# EAGLE design W076XX (EAGLE 6.6.0)
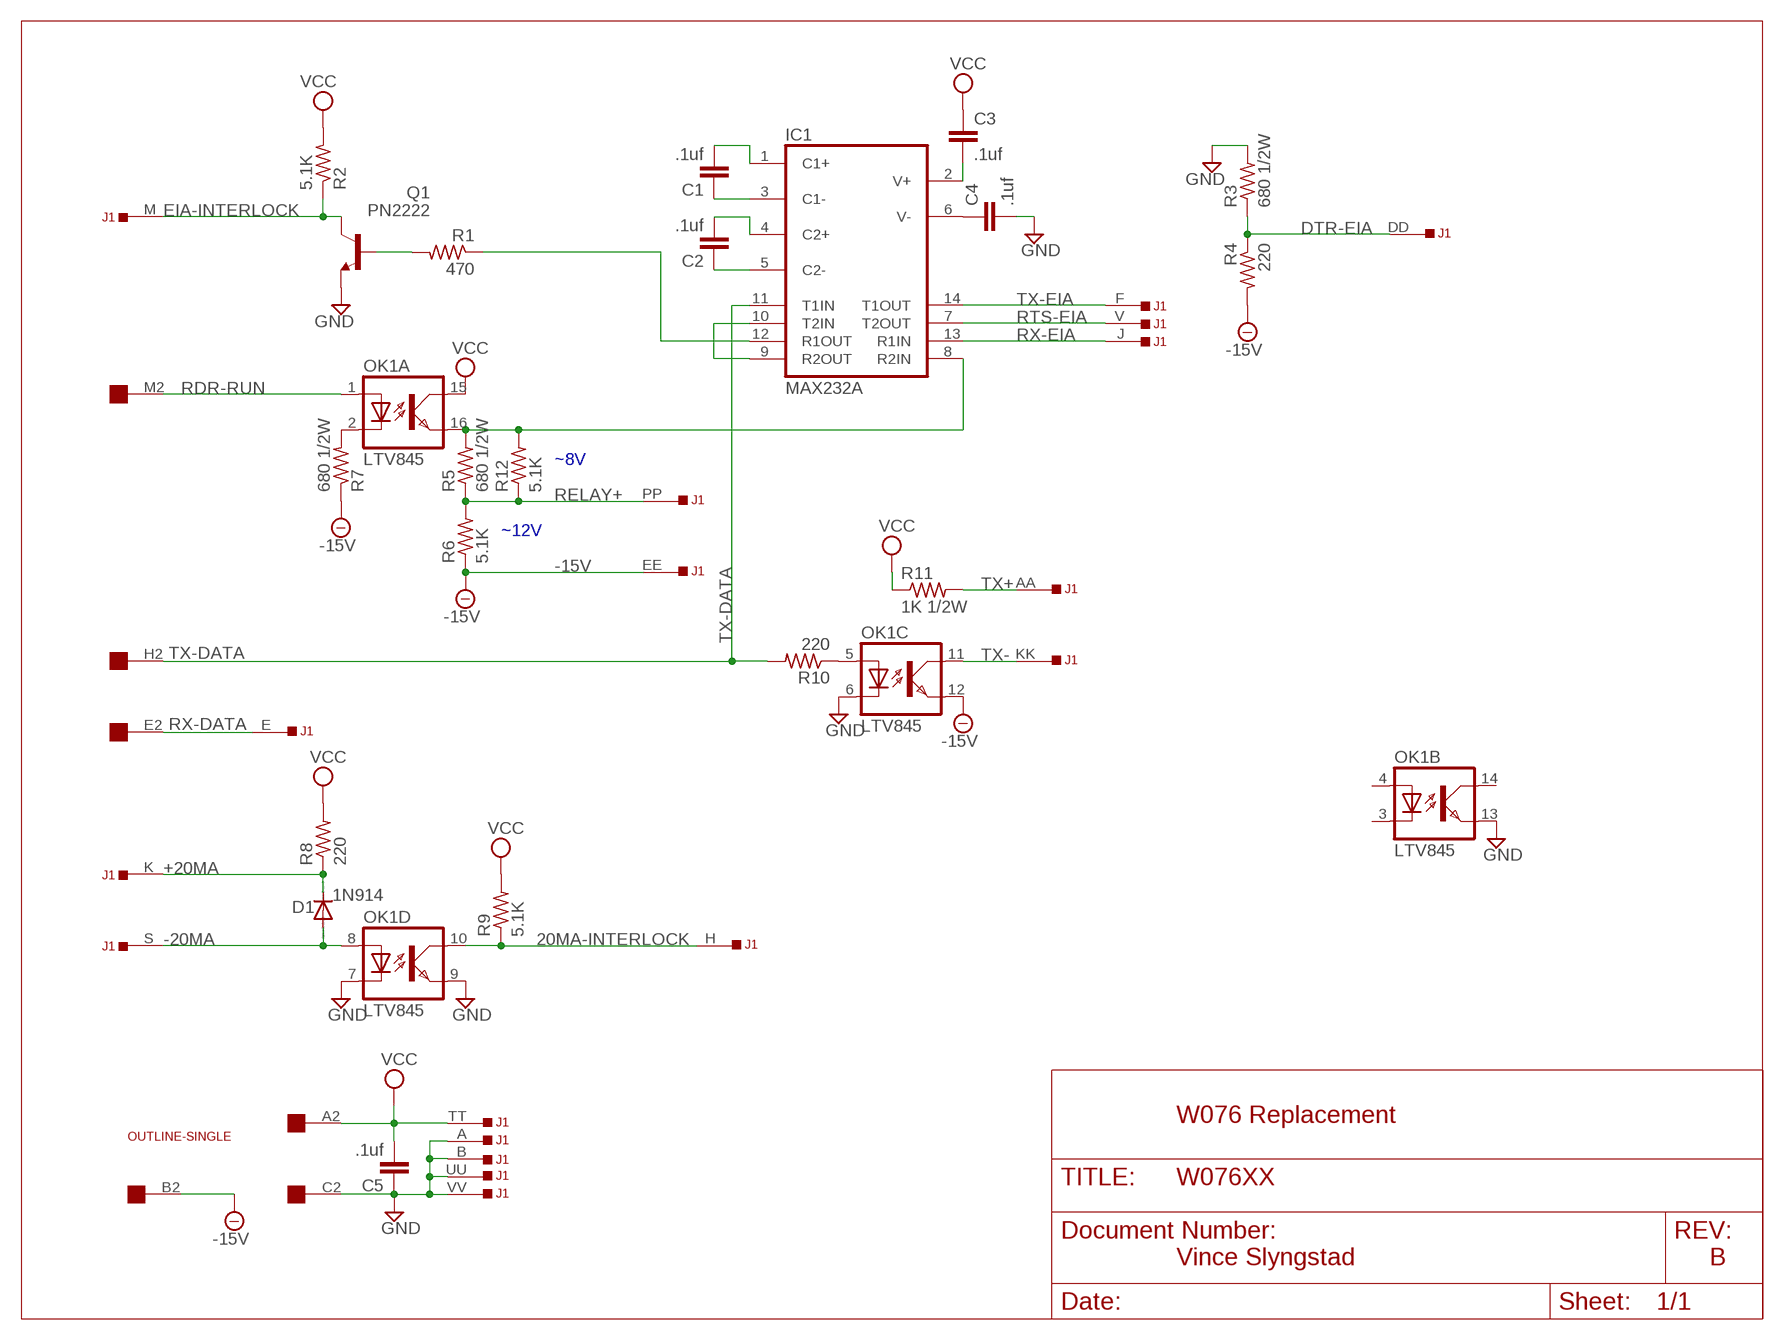
[diagram p0: schematic, sheet 1]

## Parts
C1  .1uf  C-EU050-025X075  [C050-025X075]
C2  .1uf  C-EU050-025X075  [C050-025X075]
C3  .1uf  C-EU050-025X075  [C050-025X075]
C4  .1uf  C-EU050-025X075  [C050-025X075]
C5  .1uf  C-EU050-025X075  [C050-025X075]
D1  1N914  1N4004  [DO41-10]
IC1  MAX232A  MAX232  [DIL16]
J1  DEC40PINSH  [DEC40PINH]
OK1  LTV845  ILQ1  [DIL16]
Q1  PN2222  -NPN-TO5  [TO5]
R1  470  R-US_0207/10  [0207/10]
R2  5.1K  R-US_0207/10  [0207/10]
R3  680 1/2W  R-US_0207/12  [0207/12]
R4  220  R-US_0207/10  [0207/10]
R5  680 1/2W  R-US_0207/12  [0207/12]
R6  5.1K  R-US_0207/10  [0207/10]
R7  680 1/2W  R-US_0207/12  [0207/12]
R8  220  R-US_0207/10  [0207/10]
R9  5.1K  R-US_0207/10  [0207/10]
R10  220  R-US_0207/10  [0207/10]
R11  1K 1/2W  R-US_0207/12  [0207/12]
R12  5.1K  R-US_0207/10  [0207/10]
U$2  EDGE-1  [EDGE-CON1]
U$3  OUTLINE-SINGLE  [SINGLE]

## Nets
20MA-INTERLOCK: J1.H OK1.10(D:COL) R9.1
+20MA: D1.C J1.K R8.1
-15V [supply]: J1.EE OK1.12(C:EMIT) R4.2 R6.1 R7.1 U$2.B2
-20MA: D1.A J1.S OK1.8(D:A)
DTR-EIA: J1.DD R3.1 R4.1
EIA-INTERLOCK: J1.M Q1.3(C) R2.1
GND [supply]: C4.2 C5.1 J1.A J1.B J1.UU J1.VV OK1.6(C:C) OK1.7(D:C) OK1.9(D:EMIT) OK1.13(B:EMIT) Q1.1(E) R3.2 U$2.C2
N$1: C2.1 IC1.5(C2-)
N$2: C2.2 IC1.4(C2+)
N$3: C1.2 IC1.1(C1+)
N$4: C1.1 IC1.3(C1-)
N$5: OK1.2(A:C) R7.2
N$6: IC1.9(R2OUT) IC1.10(T2IN)
N$7: IC1.8(R2IN) OK1.16(A:EMIT) R5.2 R12.2
N$8: IC1.12(R1OUT) R1.1
N$9: C3.2 IC1.2(V+)
N$10: C4.1 IC1.6(V-)
N$11: Q1.2(B) R1.2
N$15: OK1.5(C:A) R10.1
RDR-RUN: OK1.1(A:A) U$2.M2
RELAY+: J1.PP R5.1 R6.2 R12.1
RTS-EIA: IC1.7(T2OUT) J1.V
RX-DATA: J1.E U$2.E2
RX-EIA: IC1.13(R1IN) J1.J
TX+: J1.AA R11.2
TX-: J1.KK OK1.11(C:COL)
TX-DATA: IC1.11(T1IN) R10.2 U$2.H2
TX-EIA: IC1.14(T1OUT) J1.F
VCC [supply]: C3.1 C5.2 J1.TT OK1.15(A:COL) R2.2 R8.2 R9.2 R11.1 U$2.A2
Unconnected: J1.BB J1.C J1.CC J1.D J1.FF J1.HH J1.JJ J1.L J1.LL J1.MM J1.N J1.NN J1.P J1.R J1.RR J1.SS J1.T J1.U J1.W J1.X J1.Y J1.Z OK1.3(B:C) OK1.4(B:A) OK1.14(B:COL) U$2.D2 U$2.F2 U$2.J2 U$2.K2 U$2.L2 U$2.N2 U$2.P2 U$2.R2 U$2.S2 U$2.T2 U$2.U2 U$2.V2

## Notes on the sheet
- ~8V
- ~12V
- W076 Replacement
- Vince Slyngstad | B

## Power pins joined to a net without a drawn wire
GND: IC1.15(GND)
VCC: IC1.16(VCC)

## Library data of the parts
C1-C5 = rcl:C-EU: CAPACITOR, European symbol
D1 = diode:1N4004: DIODE general purpose rectifier, 1 A
IC1 = maxim:MAX232: RS232 TRANSCEIVER; MF: MAXIM; MPN: MAX232ACPE+; OC_FARNELL: 9723773; OC_NEWARK: 68K4544
J1 = dec-con:DEC40PINS: 40 pin ribbon connector for BC08, BC11 cables.
OK1 = optocoupler:ILQ1: SIEMENS OPTO COUPLER; MF: VISHAY/TELEFUNKEN; MPN: ILQ1; OC_FARNELL: 1469501; OC_NEWARK: 88K1954
Q1 = transistor:*-NPN-: NPN Transistror BF959 corrected 2008.03.06
R1-R12 = rcl:R-US_: RESISTOR, American symbol
U$2 = dec-con:EDGE-1: Single-Sided DEC Edge Connector -- (side 2)
U$3 = dec-con:OUTLINE-*: Board outlines for DEC boards.

## Net classes
1 supply: width 0.813 mm

## Board
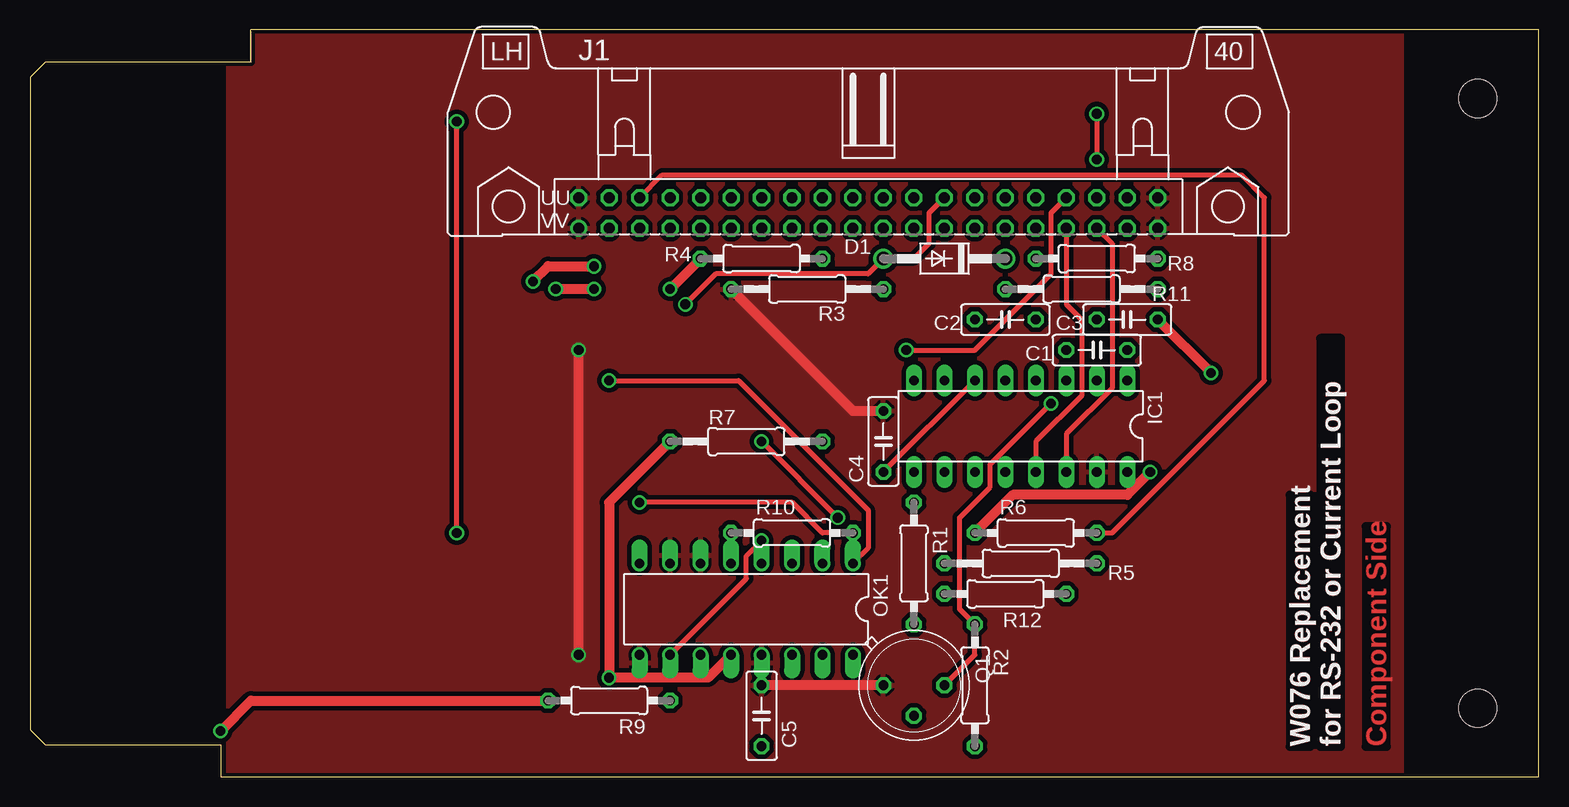
[diagram p1: board, top side]
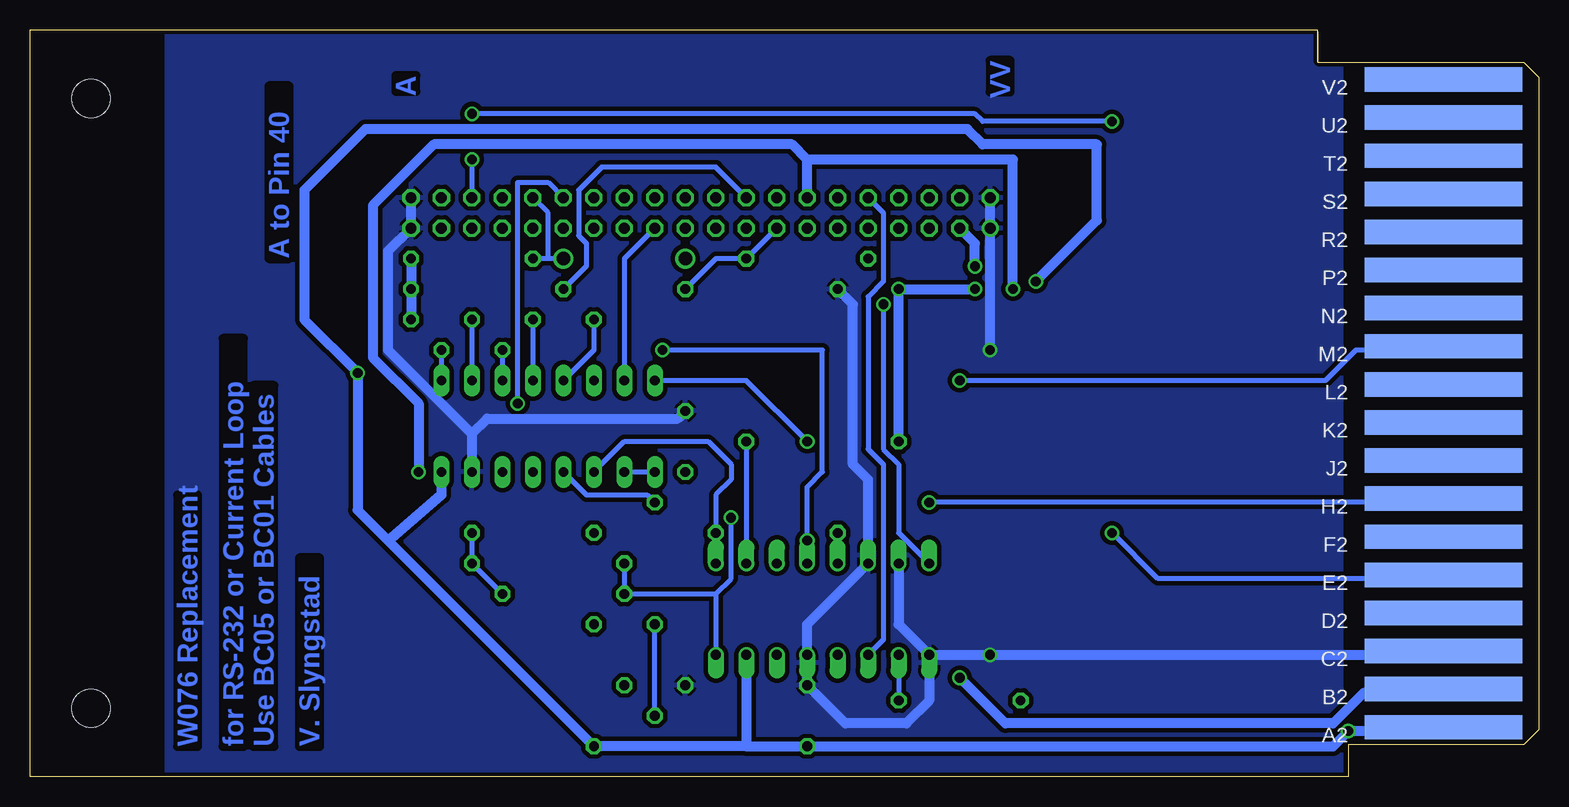
[diagram p2: board, bottom side, seen from below]

Size 125.73 x 62.23 mm. Coordinates in mm from the lower left corner, seen from the top.
Copper layers (1+16): Top 0.035mm / dielectric 1.5mm / Bottom 0.035mm
Design rules "16mils": minimum track width 16mil, minimum drill 32mil, track to track 15mil, track to pad 10mil, pad to pad 10mil, via to via 10mil, smd to smd 10mil, copper to edge 13mil, drill to drill 10mil, minimum pad ring 10mil, minimum via ring 8mil, stop-mask expansion 0mil, vias tented up to drill 0mil, thermal gap 10mil

### Footprints (pad centres in the part's own frame; a part is rotated, then mirrored left to right if it is on the bottom)
C050-025X075 = drill 0.813 octagon: 1 -2.54,0; 2 2.54,0
DO41-10 = drill 1.118: A 5.08,0; C -5.08,0
DIL16 = drill 0.813 long: 1 -8.89,-3.81; 2 -6.35,-3.81; 3 -3.81,-3.81; 4 -1.27,-3.81; 5 1.27,-3.81; 6 3.81,-3.81; 7 6.35,-3.81; 8 8.89,-3.81; 9 8.89,3.81; 10 6.35,3.81; 11 3.81,3.81; 12 1.27,3.81; 13 -1.27,3.81; 14 -3.81,3.81; 15 -6.35,3.81; 16 -8.89,3.81
DEC40PINH = drill 0.914 octagon: A 24.13,1.27; AA -3.81,1.27; B 24.13,-1.27; BB -3.81,-1.27; C 21.59,1.27; CC -6.35,1.27; D 21.59,-1.27; DD -6.35,-1.27; E 19.05,1.27; EE -8.89,1.27; F 19.05,-1.27; FF -8.89,-1.27; H 16.51,1.27; HH -11.43,1.27; J 16.51,-1.27; JJ -11.43,-1.27; K 13.97,1.27; KK -13.97,1.27; L 13.97,-1.27; LL -13.97,-1.27; M 11.43,1.27; MM -16.51,1.27; N 11.43,-1.27; NN -16.51,-1.27; P 8.89,1.27; PP -19.05,1.27; R 8.89,-1.27; RR -19.05,-1.27; S 6.35,1.27; SS -21.59,1.27; T 6.35,-1.27; TT -21.59,-1.27; U 3.81,1.27; UU -24.13,1.27; V 3.81,-1.27; W 1.27,1.27; X 1.27,-1.27; Y -1.27,1.27; Z -1.27,-1.27 | drill 0.914: VV -24.13,-1.27
DIL16' = drill 0.813 offset: 1 -8.89,-3.81; 2 -6.35,-3.81; 3 -3.81,-3.81; 4 -1.27,-3.81; 5 1.27,-3.81; 6 3.81,-3.81; 7 6.35,-3.81; 8 8.89,-3.81; 9 8.89,3.81; 10 6.35,3.81; 11 3.81,3.81; 12 1.27,3.81; 13 -1.27,3.81; 14 -3.81,3.81; 15 -6.35,3.81; 16 -8.89,3.81
TO5 = drill 0.813 octagon: 1 0,-2.54; 2 2.54,0; 3 0,2.54
0207/10 = drill 0.813 octagon: 1 -5.08,0; 2 5.08,0
0207/12 = drill 0.813 octagon: 1 -6.35,0; 2 6.35,0
EDGE-CON1 = smd 13.106 x 2.032 bottom: A2 7.938,4.128; B2 7.938,7.303; C2 7.938,10.477; D2 7.938,13.652; E2 7.938,16.828; F2 7.938,20.003; H2 7.938,23.177; J2 7.938,26.352; K2 7.938,29.527; L2 7.938,32.703; M2 7.938,35.877; N2 7.938,39.053; P2 7.938,42.227; R2 7.938,45.403; S2 7.938,48.578; T2 7.938,51.752; U2 7.938,54.928; V2 7.938,58.102
SINGLE = hole 3.175: 120.65,56.515; 120.65,5.715

### Placement (x,y rotation side)
C1  88.9,35.56 0 top
C2  81.28,38.1 0 top
C3  91.44,38.1 180 top
C4  71.12,27.94 90 top
C5  60.96,5.08 270 top
D1  76.2,43.18 180 top
IC1  82.55,29.21 180 top
J1  69.85,46.99 0 top
OK1  LTV845  [DIL16']  59.69,13.97 180 top
Q1  73.66,7.62 270 top
R1  73.66,17.78 270 top
R2  78.74,7.62 270 top
R3  64.77,40.64 180 top
R4  60.96,43.18 180 top
R5  82.55,17.78 180 top
R6  83.82,20.32 0 top
R7  59.69,27.94 0 top
R8  88.9,43.18 0 top
R9  48.26,6.35 180 top
R10  63.5,20.32 0 top
R11  87.63,40.64 180 top
R12  81.28,15.24 180 top
U$2  0,0 0 top
U$3  0,0 0 top

### Tracks (layer width: path | path; a pad name or v marks a point on that pad's centre or on a via)
20MA-INTERLOCK  (via drill 0.81)
  Top 0.406: J1.H 85.09,46.99 85.09,41.91 78.74,35.56 v73.03,35.56 | v60.96,19.68 59.69,18.41 59.69,16.51 OK1.10
  Bottom 0.406: OK1.10 R9.1 | v73.03,35.56 59.69,35.56 59.69,25.4 60.96,24.13 v60.96,19.68
+20MA
  Bottom 0.406: D1.C 82.55,43.18 | 82.55,43.18 R8.1 | J1.K 82.55,46.99 82.55,43.18
-15V  (via drill 0.81)
  Top 0.813: R6.1 81.92,23.5 91.44,23.5 v93.35,25.4 | v53.34,40.64 R4.2 | v46.99,40.64 v43.82,40.64 | R7.1 48.26,22.86 v48.26,8.26 56.52,8.26 OK1.12
  Bottom 0.813: v93.35,25.4 93.35,31.11 97.16,34.92 97.16,47.62 92.08,52.7 62.23,52.7 60.96,51.44 | J1.EE 60.96,51.44 | R7.1 v53.34,40.64 v46.99,40.64 | U$2.B2 8.26,6.99 14.61,6.99 17.15,4.45 44.45,4.45 v48.26,8.26 | 60.96,51.44 43.82,51.44 v43.82,40.64
-20MA  (via drill 0.81)
  Top 0.406: v54.61,39.37 57.15,41.91 69.85,41.91 D1.A 73.66,43.18 74.93,44.45 74.93,46.99 J1.S
  Bottom 0.406: OK1.8 53.34,20.32 53.34,26.04 54.61,27.3 v54.61,39.37
DTR-EIA
  Bottom 0.406: J1.DD R4.1 68.58,43.18 R3.1
EIA-INTERLOCK  (via drill 0.81)
  Top 0.406: v85.09,31.11 80.01,26.04 80.01,24.13 77.47,21.59 77.47,13.97 R2.1 78.74,10.16 Q1.3
  Bottom 0.406: J1.M 82.55,49.53 85.09,49.53 v85.09,31.11
GND  (via drill 0.81)
  Top 0.813: C4.2 68.58,30.48 R3.2 | v45.72,10.16 v45.72,35.56 | Q1.1 C5.1
  Bottom 0.813: C4.2 71.76,29.84 87.63,29.84 88.9,28.57 | 88.9,28.57 95.89,35.56 95.89,43.81 J1.B J1.A | R3.2 57.15,39.37 57.15,26.04 55.88,24.77 OK1.6 60.96,12.7 OK1.13 C5.1 57.79,4.45 52.71,4.45 50.8,6.35 OK1.9 | OK1.9 53.34,12.7 OK1.7 | OK1.9 v45.72,10.16 8.26,10.16 U$2.C2 | v45.72,35.56 J1.VV J1.UU | 88.9,28.57 IC1.15
  pour Top: 17.78,62.23 16.51,62.23 16.51,0 114.3,0 114.3,62.23
  pour Bottom: 17.78,62.23 16.51,62.23 16.51,0 114.3,0 114.3,62.23
N$1
  Bottom 0.406: IC1.5 78.74,35.56 C2.1
N$2
  Bottom 0.406: C2.2 IC1.4
N$3
  Bottom 0.406: C1.2 IC1.1
N$4
  Bottom 0.406: C1.1 IC1.3
N$5
  Bottom 0.406: R7.2 OK1.2
N$6
  Bottom 0.406: IC1.10 IC1.9
N$7  (via drill 0.81)
  Top 0.406: v67.31,21.59 v60.96,27.94
  Bottom 0.406: 68.58,15.24 R12.2 R5.2 | 68.58,15.24 OK1.16 | IC1.8 66.04,33.02 v60.96,27.94 | v67.31,21.59 67.31,16.51 68.58,15.24
N$8
  Bottom 0.406: R1.1 74.3,23.5 79.38,23.5 IC1.12
N$9
  Bottom 0.406: C3.2 IC1.2
N$10
  Top 0.406: IC1.6 C4.1
N$11
  Bottom 0.406: Q1.2 R1.2
N$15
  Bottom 0.406: R10.1 OK1.5
RDR-RUN  (via drill 0.81)
  Top 0.406: OK1.1 69.85,19.05 69.85,22.23 59.06,33.02 v48.26,33.02
  Bottom 0.406: U$2.M2 8.26,35.56 15.24,35.56 17.78,33.02 v48.26,33.02
RELAY+
  Top 0.406: J1.PP 52.71,50.16 100.97,50.16 102.87,48.26 102.87,33.02 90.17,20.32 R6.2
  Bottom 0.406: R6.2 R5.1 R12.1
RTS-EIA
  Bottom 0.406: IC1.7 76.2,43.18 J1.V
RX-DATA  (via drill 0.81)
  Top 0.406: v88.9,55.24 v88.9,51.44 | v35.56,20.32 v35.56,54.61
  Bottom 0.406: v88.9,51.44 J1.E | v88.9,55.24 46.99,55.24 46.36,54.61 v35.56,54.61 | v35.56,20.32 31.75,16.51 8.26,16.51 U$2.E2
RX-EIA
  Top 0.406: IC1.13 83.82,27.94 87.63,31.75 87.63,38.1 86.36,39.37 J1.J
TX+
  Bottom 0.406: R11.2 79.38,42.55 79.38,44.45 80.01,45.09 80.01,48.9 78.11,50.8 68.58,50.8 J1.AA
TX-
  Bottom 0.406: OK1.11 54.61,11.43 54.61,26.04 55.88,27.3 55.88,40.01 54.61,41.27 54.61,46.99 J1.KK
TX-DATA  (via drill 0.81)
  Top 0.406: R10.2 66.04,20.32 63.5,22.86 v50.8,22.86
  Bottom 0.406: R10.2 68.58,23.5 67.31,24.77 67.31,26.04 69.22,27.94 76.2,27.94 IC1.11 | U$2.H2 8.26,22.86 v50.8,22.86
TX-EIA
  Top 0.406: IC1.14 86.36,28.57 90.17,32.38 90.17,44.45 J1.F
VCC  (via drill 0.81)
  Top 0.813: R9.2 18.42,6.35 v15.88,3.81 | v46.99,42.55 43.18,42.55 v41.91,41.27 | v98.43,33.66 C3.1
  Bottom 0.813: U$2.A2 8.26,3.81 v15.88,3.81 17.15,2.54 C5.2 66.04,2.54 | OK1.15 66.04,2.54 | 66.04,2.54 R2.2 95.89,19.68 | R8.2 R11.1 C3.1 | J1.TT 46.99,44.45 v46.99,42.55 | v41.91,41.27 36.83,46.35 36.83,52.7 46.36,52.7 47.63,53.98 97.79,53.98 102.87,48.9 102.87,38.1 v98.43,33.66 98.43,22.23 95.89,19.68 | 95.89,19.68 91.44,23.5 IC1.16

### Text on the board
Top: W076 Replacement | for RS-232 or Current Loop | Component Side
Bottom: VV | A | A to Pin 40 | V. Slyngstad | Use BC05 or BC01 Cables | for RS-232 or Current Loop | W076 Replacement
tPlace: W076 Replacement | for RS-232 or Current Loop
_layer121: PL1 | PL1 | 40 | 40 | V1 | V1 | V1 | V1 | V1 | V1 | V1 | V1 | V1 | V1 | V1 | V1 | V1 | V1 | V1 | V1 | V1 | V1 | V1 | V1 | V1 | V1 | V1 | V1 | V1 | V1 | V1 | V1 | V1 | V1 | V1 | V1 | V1 | V1 | V1 | V1 | V1 | V1 | V1 | V1 | V1 | V1 | V1 | V1 | V1 | V1 | V1 | V1 | V1 | V1 | V1 | V1 | V1 | V1 | V1 | V1 | V1 | V1 | V1 | V1 | V1 | V1 | V1 | V1 | 1n914 | 1n914 | R8 | R8 | PAD8 | PAD8 | 220 | 220 | 220 | 220 | R4 | R4 | 680 1/2W | 680 1/2W | 1n914 | 1n914 | D1 | D1 | 220 | 220 | .1uf | .1uf | C2 | C2 | PAD6 | PAD6 | R3 | R3 | R11 | R11 | C1 | C1 | D2 | D2 | C3 | C3 | .1uf | .1uf | PAD1 | PAD1 | PAD2 | PAD2 | .1uf | .1uf | IC1 | IC1 | PAD3 | PAD3 | PAD4 | PAD4 | MAX232A | MAX232A | R7 | R7 | 680 1/2W | 680 1/2W | 220 | 220 | C4 | C4 | .1uf | .1uf | PAD10 | PAD10 | R1 | R1 | R10 | R10 | R6 | R6 | 220 | 220 | 5.1K | 5.1K | 150 1/2W | 150 1/2W | 1n914 | 1n914 | D4 | D4 | R5 | R5 | OK1 | OK1 | ISQ203 | ISQ203 | PAD7 | PAD7 | .1uf | .1uf | C5 | C5 | PAD5 | PAD5 | PAD9 | PAD9 | R2 | R2 | 5.1K | 5.1K | 5.1K | 5.1K | R9 | R9 | A1 | A1 | A1 | A1 | A1 | A1 | A1 | A1 | A1 | A1 | A1 | A1 | A1 | A1 | A1 | A1 | A1 | A1 | A1 | A1 | A1 | A1 | A1 | A1 | A1 | A1 | A1 | A1 | A1 | A1 | A1 | A1 | A1 | A1 | A1 | A1 | A1 | A1 | A1 | A1 | A1 | A1 | A1 | A1 | A1 | A1 | A1 | A1 | A1 | A1 | A1 | A1 | A1 | A1 | A1 | A1 | A1 | A1 | A1 | A1 | A1 | A1 | A1 | A1 | W076 Replacement | W076 Replacement | for RS-232 or Current Loop | for RS-232 or Current Loop